# EAGLE design MF_badge_2021_rev_A (EAGLE 9.6.2)
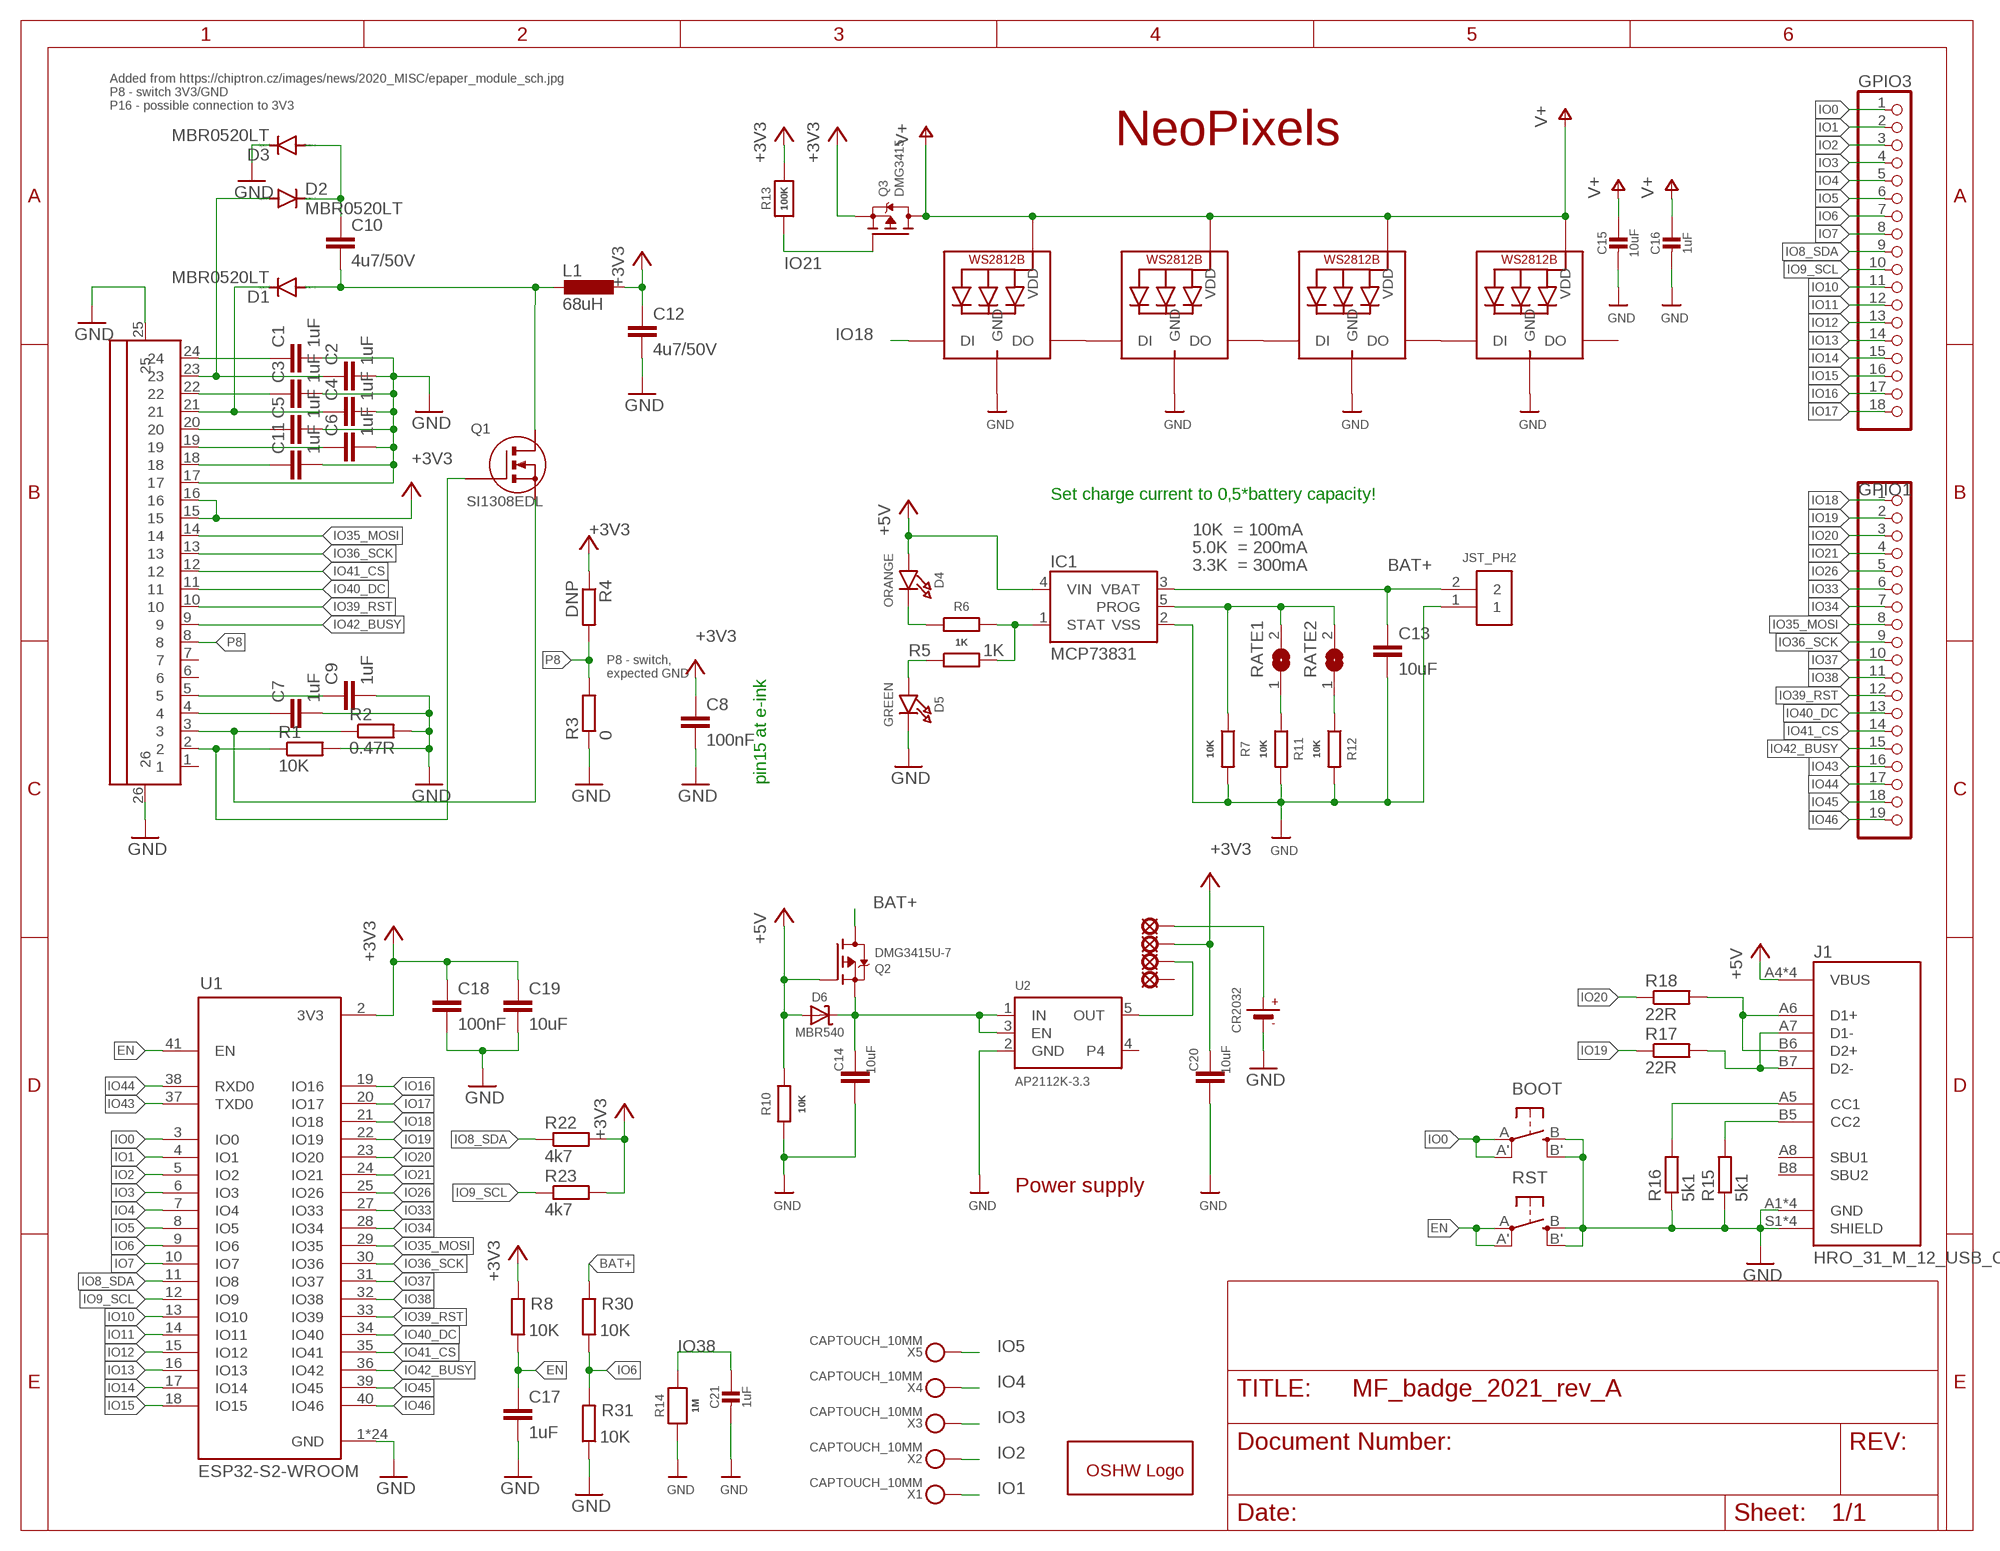
[diagram p0: schematic, sheet 1]

## Parts
BOOT  BUTTON_KMR2_4.6X2.8  [BUTTON_KMR2_4.6X2.8]
C1  1uF  C-EUC0603K  [C0603K]
C2  1uF  C-EUC0603K  [C0603K]
C3  1uF  C-EUC0603K  [C0603K]
C4  1uF  C-EUC0603K  [C0603K]
C5  1uF  C-EUC0603K  [C0603K]
C6  1uF  C-EUC0603K  [C0603K]
C7  1uF  C-EUC0603K  [C0603K]
C8  100nF  C-EUC0603K  [C0603K]
C9  1uF  C-EUC0603K  [C0603K]
C10  4u7/50V  C-EUC1206  [C1206]
C11  1uF  C-EUC0603K  [C0603K]
C12  4u7/50V  C-EUC1206  [C1206]
C13  10uF  C-EUC0603  [C0603]
C14  10uF  C-EUC0603  [C0603]
C15  10uF  CAP_CERAMIC0603_NO  [0603-NO]
C16  1uF  CAP_CERAMIC0603_NO  [0603-NO]
C17  1uF  C-EUC0603K  [C0603K]
C18  100nF  C-EUC0603K  [C0603K]
C19  10uF  C-EUC1206  [C1206]
C20  10uF  C-EUC0603  [C0603]
C21  1uF  CAP_CERAMIC0603_NO  [0603-NO]
CR2032  BATTERYCR2032_BAT-HLD-001  [CR2032_SMT_BAT-HLD-001]
D1  MBR0520LT  [SOD123]
D2  MBR0520LT  [SOD123]
D3  MBR0520LT  [SOD123]
D4  ORANGE  LED0603  [CHIPLED_0603]
D5  GREEN  LED0603  [CHIPLED_0603]
D6  MBR540  DIODE-SCHOTTKYSOD-123  [SOD-123]
GOLD_ORB_SM1  OSHWLOGO_  [OSHW_5MM_LOGO]
GPIO1  PINHD-1X19  [1X19]
GPIO3  PINHD-1X18  [1X18]
IC1  MCP73831  [SOT95P290X120-5]
J1  HRO_31_M_12_USB_C  [HRO_31_M_12_USB_C]
L1  68uH  L-EUL4532P  [L4532P]
LED2  WS2812B5050  [WS2812B]
LED3  WS2812B5050  [WS2812B]
LED4  WS2812B5050  [WS2812B]
LED5  WS2812B5050  [WS2812B]
LSP1  MCS10B  [MCS10B]
LSP2  MCS10B  [MCS10B]
LSP3  MCS10B  [MCS10B]
LSP4  MCS10B  [MCS10B]
Q1  SI1308EDL  [SC-70]
Q2  DMG3415U-7  MOSFET-P  [SOT23-R]
Q3  DMG3415  MOSFET-P  [SOT23-R]
R1  10K  R-EU_R0603  [R0603]
R2  0.47R  R-EU_R0603  [R0603]
R3  0  R-EU_R0603  [R0603]
R4  DNP  R-EU_R0603  [R0603]
R5  1K  R-EU_R0603  [R0603]
R6  1K  R-EU_R0603  [R0603]
R7  10K  R-EU_R0603  [R0603]
R8  10K  R-EU_R0603  [R0603]
R10  10K  R-EU_R0603  [R0603]
R11  10K  R-EU_R0603  [R0603]
R12  10K  R-EU_R0603  [R0603]
R13  100K  RESISTOR_0603_NOOUT  [0603-NO]
R14  1M  RESISTOR_0603_NOOUT  [0603-NO]
R15  5k1  R-EU_R0603  [R0603]
R16  5k1  R-EU_R0603  [R0603]
R17  22R  R-EU_R0603  [R0603]
R18  22R  R-EU_R0603  [R0603]
R22  4k7  R-EU_R0603  [R0603]
R23  4k7  R-EU_R0603  [R0603]
R30  10K  R-EU_R0603  [R0603]
R31  10K  R-EU_R0603  [R0603]
RATE1  SOLDERJUMPER  [SOLDERJUMPER_ARROW_NOPASTE]
RATE2  SOLDERJUMPER  [SOLDERJUMPER_ARROW_NOPASTE]
RST  BUTTON_KMR2_4.6X2.8  [BUTTON_KMR2_4.6X2.8]
U1  ESP32-S2-WROOM  [XCVR_ESP32-S2-WROOM]
U2  AP2112K-3.3  VREG_SOT23-5  [SOT23-5]
U$1  2.13_EINK  [2.13_EINK]
U$8  JST_PH2  [JSTPH2]
X1  CAPTOUCH_10MM  CAPTOUCH_MONOPAD_6X9  [CAPTOUCH_6X9MM]
X2  CAPTOUCH_10MM  CAPTOUCH_MONOPAD_6X9  [CAPTOUCH_6X9MM]
X3  CAPTOUCH_10MM  CAPTOUCH_MONOPAD_6X9  [CAPTOUCH_6X9MM]
X4  CAPTOUCH_10MM  CAPTOUCH_MONOPAD_6X9  [CAPTOUCH_6X9MM]
X5  CAPTOUCH_10MM  CAPTOUCH_MONOPAD_6X9  [CAPTOUCH_6X9MM]

## Nets
+3V3 [power]: C8.1 C12.1 C18.1 C19.1 C20.1 L1.1 LSP2.MP Q3.2(S) R4.1 R8.2 R13.2 R22.2 R23.2 U1.2(3V3) U$1.15 U$1.16
+5V [power]: D4.A D6.A IC1.4(VIN) J1.A4(VBUS) J1.A9(VBUS) J1.B4(VBUS) J1.B9(VBUS) Q2.1(G) R10.2
BAT+: C13.1 IC1.3(VBAT) Q2.3(D) R30.2 U$8.2
D+_CON: J1.A6(D1+) J1.B6(D2+) R18.2
D-_CON: J1.A7(D1-) J1.B7(D2-) R17.2
EN: C17.1 R8.1 RST.A'(P1) RST.A(P) U1.41(EN)
GND: BOOT.B'(S1) BOOT.B(S) C1.2 C2.2 C3.2 C4.2 C5.2 C6.2 C7.2 C8.2 C9.2 C11.2 C12.2 C13.2 C14.2 C15.2 C16.2 C17.2 C18.2 C19.2 C20.2 C21.2 CR2032.- D3.C D5.C IC1.2(VSS) J1.A1(GND) J1.A12(GND) J1.B1(GND) J1.B12(GND) J1.S1(SHIELD) J1.S2(SHIELD) J1.S3(SHIELD) J1.S4(SHIELD) LED2.3-GND(GND) LED3.3-GND(GND) LED4.3-GND(GND) LED5.3-GND(GND) R1.2 R2.2 R3.1 R7.2 R10.1 R11.2 R12.2 R14.1 R15.1 R16.1 R31.1 RST.B'(S1) RST.B(S) U1.1(GND) U1.26(GND) U1.42(GND) U1.43.1(GND) U1.43.2(GND) U1.43.3(GND) U1.43.4(GND) U1.43.5(GND) U1.43.6(GND) U1.43.7(GND) U1.43.8(GND) U1.43.9(GND) U1.43.10(GND) U1.43.11(GND) U1.43.12(GND) U1.43.13(GND) U1.43.14(GND) U1.43.15(GND) U1.43.16(GND) U1.43.17(GND) U1.43.18(GND) U1.43.19(GND) U1.43.20(GND) U1.43.21(GND) U2.2(GND) U$1.17 U$1.25 U$1.26 U$8.1
IO0: BOOT.A'(P1) BOOT.A(P) GPIO3.1 U1.3(IO0)
IO1: GPIO3.2 U1.4(IO1) X1.P$1
IO2: GPIO3.3 U1.5(IO2) X2.P$1
IO3: GPIO3.4 U1.6(IO3) X3.P$1
IO4: GPIO3.5 U1.7(IO4) X4.P$1
IO5: GPIO3.6 U1.8(IO5) X5.P$1
IO6: GPIO3.7 R30.1 R31.2 U1.9(IO6)
IO7: GPIO3.8 U1.10(IO7)
IO8_SDA: GPIO3.9 R22.1 U1.11(IO8)
IO9_SCL: GPIO3.10 R23.1 U1.12(IO9)
IO10: GPIO3.11 U1.13(IO10)
IO11: GPIO3.12 U1.14(IO11)
IO12: GPIO3.13 U1.15(IO12)
IO13: GPIO3.14 U1.16(IO13)
IO14: GPIO3.15 U1.17(IO14)
IO15: GPIO3.16 U1.18(IO15)
IO16: GPIO3.17 U1.19(IO16)
IO17: GPIO3.18 U1.20(IO17)
IO18: GPIO1.1 LED2.4-DIN(DI) U1.21(IO18)
IO19: GPIO1.2 R17.1 U1.22(IO19)
IO20: GPIO1.3 R18.1 U1.23(IO20)
IO21: GPIO1.4 Q3.1(G) R13.1 U1.24(IO21)
IO26: GPIO1.5 U1.25(IO26)
IO33: GPIO1.6 U1.27(IO33)
IO34: GPIO1.7 U1.28(IO34)
IO35_MOSI: GPIO1.8 U1.29(IO35) U$1.14
IO36_SCK: GPIO1.9 U1.30(IO36) U$1.13
IO37: GPIO1.10 U1.31(IO37)
IO38: C21.1 GPIO1.11 R14.2 U1.32(IO38)
IO39_RST: GPIO1.12 U1.33(IO39) U$1.10
IO40_DC: GPIO1.13 U1.34(IO40) U$1.11
IO41_CS: GPIO1.14 U1.35(IO41) U$1.12
IO42_BUSY: GPIO1.15 U1.36(IO42) U$1.9
IO43: GPIO1.16 U1.37(TXD0)
IO44: GPIO1.17 U1.38(RXD0)
IO45: GPIO1.18 U1.39(IO45)
IO46: GPIO1.19 U1.40(IO46)
N$1: C1.1 U$1.24
N$2: C2.1 D2.A U$1.23
N$3: C3.1 U$1.22
N$4: C4.1 D1.C U$1.21
N$5: C5.1 U$1.20
N$6: C6.1 U$1.19
N$7: C11.1 U$1.18
N$8: IC1.1(STAT) R5.2 R6.2
N$9: C14.1 D6.C Q2.2(S) U2.1(IN) U2.3(EN)
N$10: Q1.2(S) R2.1 U$1.3
N$11: C9.1 U$1.5
N$12: C7.1 U$1.4
N$13: Q1.1(G) R1.1 U$1.2
N$15: D4.C R6.1
N$16: C10.1 D2.C D3.A
N$17: LED2.2-DOUT(DO) LED3.4-DIN(DI)
N$18: D5.A R5.1
N$19: C10.2 D1.A L1.2 Q1.3(D)
N$20: R11.1 RATE1.1
N$21: R12.1 RATE2.1
N$22: LED4.2-DOUT(DO) LED5.4-DIN(DI)
N$23: J1.B5(CC2) R15.2
N$24: J1.A5(CC1) R16.2
N$25: LED3.2-DOUT(DO) LED4.4-DIN(DI)
N$26: CR2032.+$1(+) CR2032.+$2(+) LSP1.MP
OUT [power]: LSP3.MP U2.5(OUT)
P8: R3.2 R4.2 U$1.8
PROG: IC1.5(PROG) R7.1 RATE1.2 RATE2.2
V+: C15.1 C16.1 LED2.1-VDD(VDD) LED3.1-VDD(VDD) LED4.1-VDD(VDD) LED5.1-VDD(VDD) Q3.3(D)
Unconnected: J1.A8(SBU1) J1.B8(SBU2) LED5.2-DOUT(DO) LSP4.MP U2.4 U$1.1 U$1.6 U$1.7

## Notes on the sheet
- Added from https://chiptron.cz/images/news/2020_MISC/epaper_module_sch.jpg
  P8 - switch 3V3/GND
  P16 - possible connection to 3V3
- NeoPixels
- Set charge current to 0,5*battery capacity!
- 10K  = 100mA
- 5.0K  = 200mA
- 3.3K  = 300mA
- P8 - switch,
  expected GND
- pin15 at e-ink
- Power supply

## Library data of the parts
BOOT RST = dronecz:BUTTON_KMR2_4.6X2.8: SMT Tact Switches 6x6mm - Digikey: P12940SCT-ND KMR2 (4.6x2.8mm) - Digikey: 401-1426-1-ND EVQ-PQHB55 - Light Touch, 160GF (4.5x4.5mm) - Digikey: P8090SCT-ND Farnell (KMR221NG) - 2845727
C1-C14 C17-C20 = rcl:C-EU: CAPACITOR, European symbol; SPICEPREFIX: C
C15 C16 C21 = microbuilder:CAP_CERAMIC: Ceramic Capacitors For new designs, use the packages preceded by an '_' character since they are more reliable: The following footprints should be used on most boards: _0402 - Standard footprint for regular board layouts _0603 - Standard footprint for regular board layouts _0805 - Standard footprint for regular board layouts _1206 - Standard footprint for regular board layouts For extremely tight-pitch boards where space is at a premium, the following 'micro-pitch' footprints can be used (smaller pads, no silkscreen outline, etc.): _0402MP - Micro-pitch footprint for very dense/compact boards _0603MP - Micro-pitch footprint for very dense/compact boards _0805MP - Micro-pitch footprint for very dense/compact boards _1206MP - Micro-pitch footprint for very dense/compact boards
CR2032 = microbuilder:BATTERY: CR1220 SMT - Digikey: 3001K-ND CD2032 BAT-HLD-001 - Digikey: BAT-HLD-001-ND
D1-D3 = diode:MBR0520LT: SCHOTTKY BARRIER RECTIFIER Source: http://onsemi.com .. MBR0520LT1-D.pdf
D4 D5 = microbuilder:LED: LED 0603 - 0603 Surface Mount Package 2mA: Green LED - Low Power (3.9mcd, 2ma, 1.7Vf) - Digikey: 475-2709-2-ND Orange LED - Low Power (9.8mcd, 2ma, 1.8Vf) - Digikey: 475-1194-2-ND Red LED - Low Power (5mcd, 2ma, 1.8Vf) - Digikey: 475-1195-2-ND Yellow LED - Low Power (7mcd, 2ma, 1.8Vf) - Digikey: 475-1196-2-ND 5mA: Blue LED - Low Power (17mcd, 5ma, 2.9Vf) - Digikey: LNJ937W8CRACT-ND 0805 - 0805 Surface Mount Package 2mA: Red LED (8.8mcd, 2mA, 1.8Vf, Clear) - Low Power [Digikey: 475-2510-1-ND] Green LED (5mcd, 2mA, 1.8Vf, Clear) - Low Power [Digikey: 475-2730-1-ND] Yellow LED (11.3mcd, 2mA, 1.8Vf, Clear) - Low Power [Digikey: 475-2555-1-ND] 20mA: Red LED (104mcd, 20mA, Diffused) - LS R976 [Digikey: 475-1278-6-ND] Red LED (12mcd, 20mA, 2.0Vf, Clear) - APT2012EC [Digikey: 754-1128-1-ND] Green LED (15mcd, 20mA, 2.2Vf, Clear) - APT2012GC [Digikey: 754-1131-1-ND] Orange LED (160mcd, 20mA, 2.1Vf, Clear) - APT2012SECK [Digikey: 754-1130-1-ND] 1206 - 1206 Surface Mount Package Green LED (26mcd, 20mA, Diffused) - LG N971 [Digikey: 475-1407-6-ND] Red LED (15mcd, 20mA, Diffused) - LH N974 [Digikey: 475-1416-6-ND] Cree - Cree High-Power Surface Mount LEDs XPEBWT-L1-0000-00D50 - White 111lm 350mA 2.9Vf 6200K 110° XTEAWT-00-0000-00000LEE3 - White 114lm 350mA 2.85Vf 5000K 115° Everlight - Everlight 45-21 Series Surface Mount LEDs 45-21/QK2C-B2832AC2CB2/2T - Warm White 2000mcd 20mA 3.25Vf 3050K 120° 45-21/LK2C-B38452C4CB2/2T - Nuetral White 2000mcd 20mA 3.25Vf 4150K 120° 45-21/LK2C-B50634C6CB2/2T - Cold White 2200mcd 20mA 3.25Vf 5650K 120° PLCC2 Reverse Mount LS T77K-J1L2-1-0-2-R18-Z - Red 11.25mcd 2mA 1.8Vf 630nm 120° LO T77K-L1M2-24-Z - Orange 19.6mcd 2mA 1.8Vf 606nm 120° LY T77K-K2M1-26-Z - Yellow 15.7mcd 2mA 1.8Vf 587nm 120°
D6 = microbuilder:DIODE-SCHOTTKY
GOLD_ORB_SM1 = oshw:OSHWLOGO: The OSHW logo for PCB layout
GPIO1 = pinhead:PINHD-1X19: PIN HEADER
GPIO3 = pinhead:PINHD-1X18: PIN HEADER
IC1 = Bastlir:MCP73831
J1 = Bastlir:HRO_31_M_12_USB_C: USB Shielded I/O Receptacle; Type C; Right Angle; Surface Mount; Gold over Nickel
L1 = rcl:L-EU: INDUCTOR, European symbol; SPICEPREFIX: L
LED2-LED5 = microbuilder:WS2812B
LSP1-LSP4 = solpad:MCS10B: SOLDER PAD MC S1, distributor Buerklin, 15F505
Q1 = tr-j:SI1308EDL
Q2 Q3 = microbuilder:MOSFET-P: P-Channel Mosfet LEGEND VDS: Voltage Drain-Source ID: Drain Current RDS(ON): Drain-Source On-State Resistance VGS(TH): Gate-Source Threshold Voltage CISS: Drain-Source Input Capacitance SOT-23 Name VDS ID RDS(ON) VGS(TH) CISS Order Number IRLML5103 30V 760mA 600 mOhm -- 75pF @ 25V Digikey: IRLML5103PBFCT-ND IRLML6401 12V 4.3A 50 mOhm 950mV @ 250µA 830pF @ 10V Digikey: IRLML6401PBFTR-ND NTR0202PL 20V 400mA 800 mOhm 2.3V @ 250uA 70pF @ 5V Digikey: NTR0202PLT1GOSTR-ND NTR4101PT1G 20V 1.8A 85 mOhm 1.2V @ 250uA 675pF @ 10V Digikey: NTR4101PT1GOSCT-ND DMP2004K 20V 600mA 900 mOhm 1V @ 250uA 175pF @ 16V Digikey: DMP2004KDICT-ND PMV65XP 20V 3.9A 76 mOhm 950mV @ 1mA 725pF @ 20V Digikey: 568-2358-2-ND TO-252 Name VDS ID RDS(ON) VGS(TH) CISS Order Number AOD417 30V 25A 34 mOhm 3V @ 250µA 920pF @ 15V Digikey: 785-1106-2-ND PowerPak Name VDS ID RDS(ON) VGS(TH) CISS Order Number AON7401 30V 12A 14 mOhm 3V @ 250µA 2600pF @ 15V Digikey: 785-1302-1-ND
R1-R8 R10-R12 R15-R18 R22 R23 R30 R31 = rcl:R-EU_: RESISTOR, European symbol; SPICEPREFIX: R
R13 R14 = microbuilder:RESISTOR: Resistors For new designs, use the packages preceded by an '_' character since they are more reliable: The following footprints should be used on most boards: _0402 - Standard footprint for regular board layouts _0603 - Standard footprint for regular board layouts _0805 - Standard footprint for regular board layouts _1206 - Standard footprint for regular board layouts For extremely tight-pitch boards where space is at a premium, the following 'micro-pitch' footprints can be used (smaller pads, no silkscreen outline, etc.): _0402MP - Micro-pitch footprint for very dense/compact boards _0603MP - Micro-pitch footprint for very dense/compact boards _0805MP - Micro-pitch footprint for very dense/compact boards _1206MP - Micro-pitch footprint for very dense/compact boards
RATE1 RATE2 = microbuilder:SOLDERJUMPER: SMD Solder JUMPER Solder the two pads together to create a connection, or remove the solder to break it. REFLOW - Use this footprint for solder paste and reflow ovens. WAVE - Use this footprint for hand-soldering (larger pads). CLOSED - Has a trace between the two pads to ensure it is closed by default. The trace needs to be cut to disable the jumper, and can be closed again by creating a solder bridge between the two pads.; BOM: EXCLUDE
U1 = Bastlir:ESP32-S2-WROOM: WiFi 802.11b/g/n Transceiver Module 2.4GHz PCB Trace Surface Mount Check prices <https://pricing.snapeda.com/search/part/ESP32-S2-WROOM/?ref=eda>; AVAILABILITY: Bad; DESCRIPTION: WiFi 802.11b/g/n Transceiver Module 2.4GHz PCB Trace Surface Mount; MF: Espressif Systems; MP: ESP32-S2-WROOM; PACKAGE: VFQFN-56 Espressif Systems; PRICE: None
U2 = microbuilder:VREG_SOT23-5: SOT23-5 Fixed Voltage Regulators Part Current Out V Out V In V Dropout θJA (°C/W) TJ (°C) Digikey Part No. ADP121 150mA 3.3V 3.4-5.5V 0.09V @ 150mA -- -- ADP121-AUJZ33R7CT-ND ADP121 150mA 3.0V 3.1-5.5V 0.09V @ 150mA -- -- ADP121-AUJZ30R7CT-ND ADP122 300mA 3.3V 3.4-5.5V 0.085V @ 300mA -- -- ADP122AUJZ-3.3-R7CT-ND ADP1712 300mA 3.3V 3.5-5.5V 0.17V @ 300mA -- -- ADP1712AUJZ-3.3-R7TR-ND AP7311 (Low Cost) 150mA 3.3V 3.5-6V 0.15V @ 150mA -- -- AP7311-33WG-7DICT-ND LD39015M18R 150mA 1.8V 1.9V-5.5V 0.08V @ 100mA -- -- 497-6977-1-ND LP2985A-33DBVR 150mA 3.3V 3.3-16V 0.28V @ 150mA 206 150 296-18479-1-ND MCP1824T-3302E/OT 300mA 3.3V 3.5V-6V 0.2V @ 300mA -- -- MCP1824T-3302E/OTCT-ND MIC5205-2.5YM5 TR 150mA 2.5V 2.7-16V 0.165V @ 150mA -- -- 576-1257-2-ND MIC5205-3.0YM5 TR 150mA 3.0V 3.2V-16V 0.165V @ 150mA -- -- 576-1258-2-ND MIC5205-3.3YM5 TR 150mA 3.3V 3.5V-16V 0.165V @ 150mA -- -- 576-1259-2-ND TPS780330220 150mA 3.3V+2.2V 3.6-5.5V 250mV Max -- -- 296-23332-1-ND TDA3663/N1,135 100mA 3.3V 3.5-45V 0.18V @ 50mA -- -- 568-5343-1-ND Max operating temp can be calculated using θJA, TJ (max junction temperature), and power in watts. Set the "Maximum Ambient Temperature" until it reaches TJ ("Max Junction Temperature"), which is the absolute limit for safe use of the regulator: Heat Sink Temperature Calculator <http://www.daycounter.com/Calculators/Heat-Sink-Temperature-Calculator.phtml> For example, With 12V source into a 3.3V LP2985 and a 30mA load, we are dissipating (12V-3.3V) * 0.03A = 0.261W. With a θJA of 206 °C/W, a TJ of 150°C, and 261mW we can safely use the chip without a heat sink up to 75°C (=147.1°C Junction Temperature).
U$1 = dronecz:2.13_EINK
U$8 = Bastlir:JST_PH2
X1-X5 = adafruit_electromech:CAPTOUCH_MONOPAD

## Net classes
1 power: width 0.508 mm
2 lowpower: width 0.305 mm, drill 0.483 mm

## Board
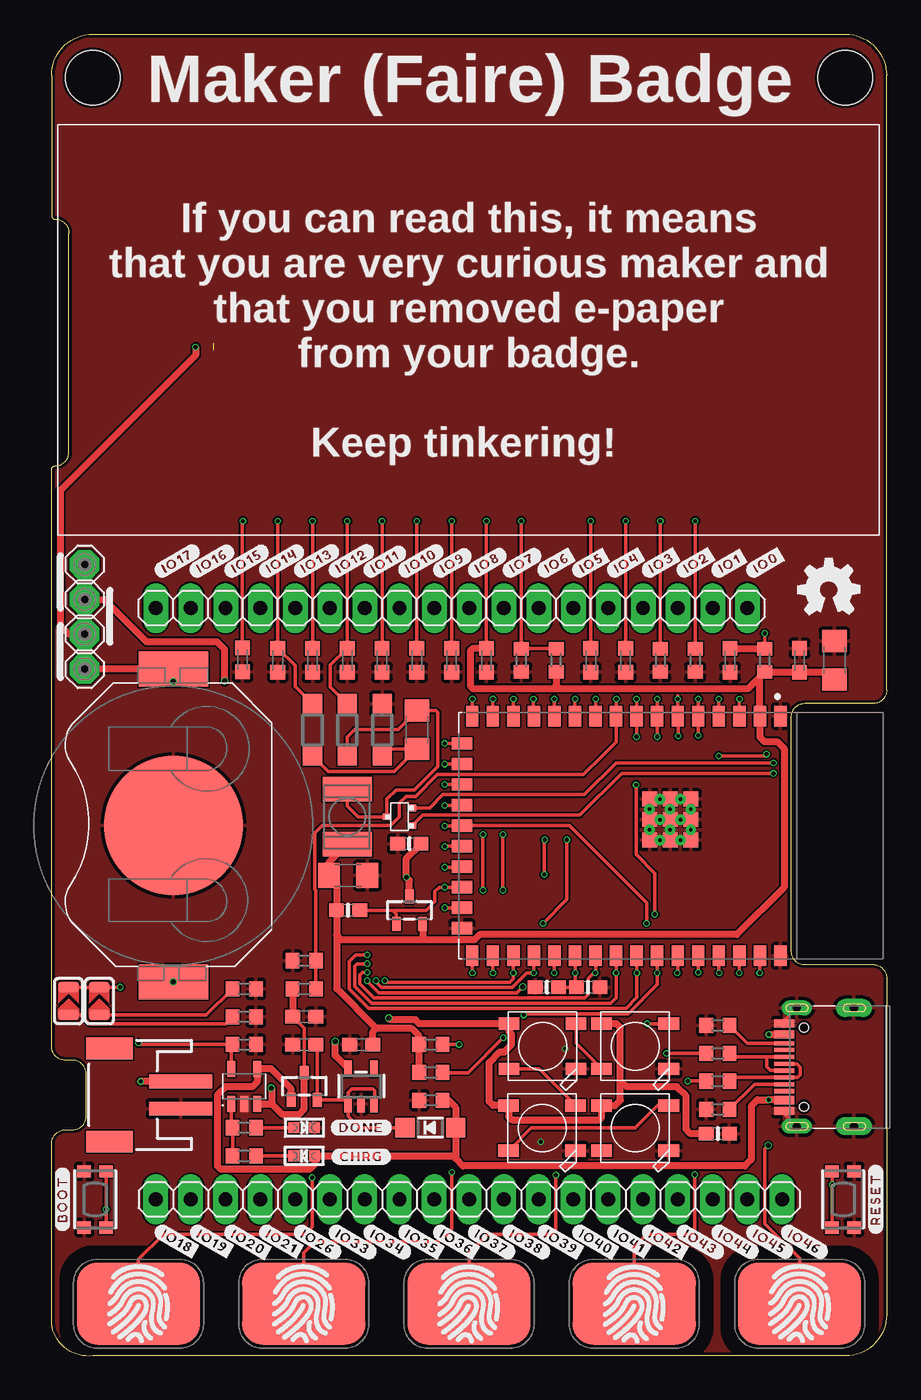
[diagram p1: board, top side]
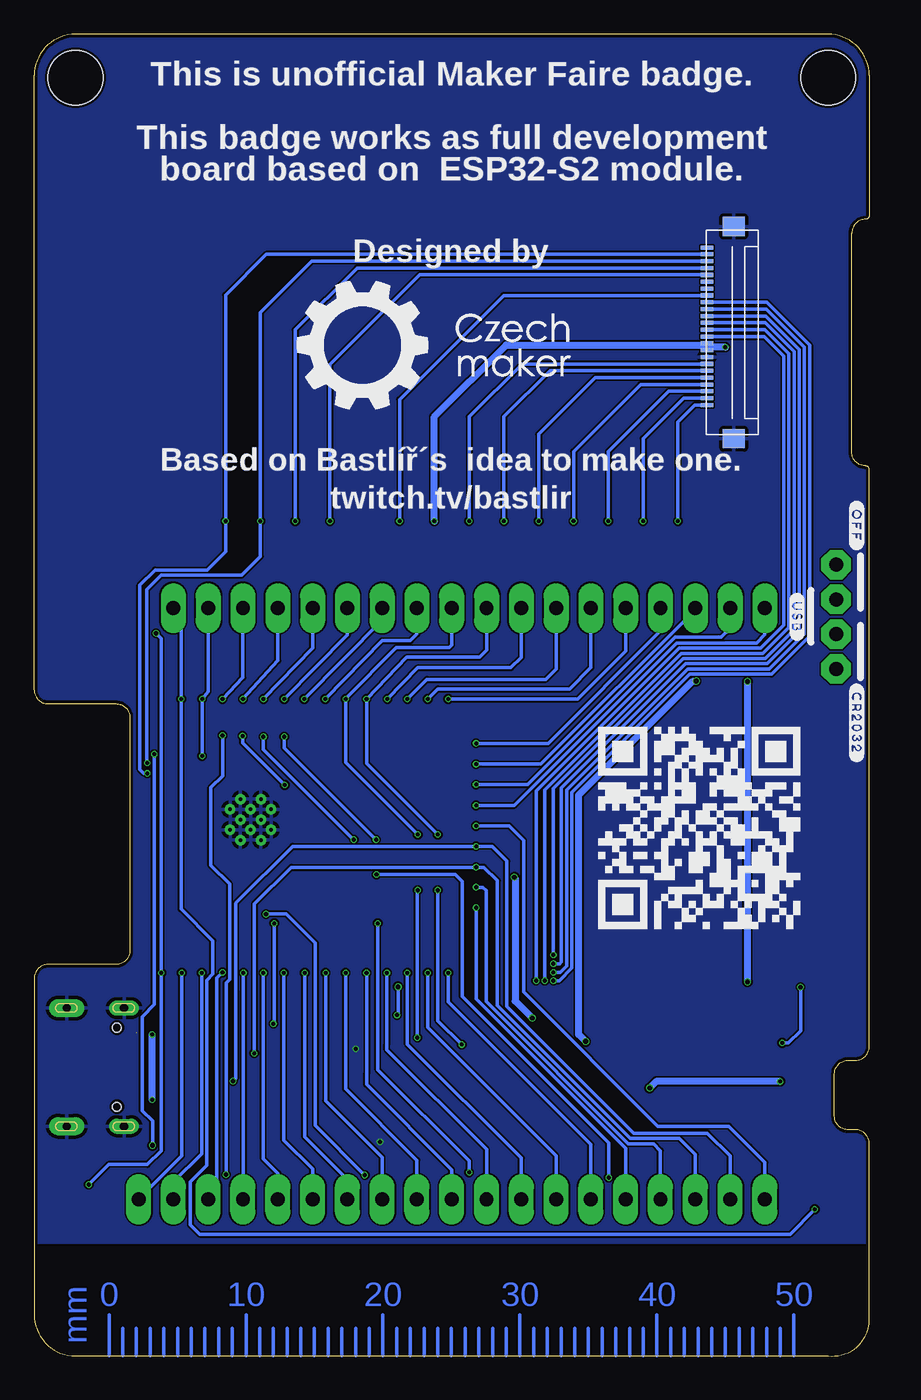
[diagram p2: board, bottom side, seen from below]

Size 60.96 x 96.54 mm. Coordinates in mm from the lower left corner, seen from the top.
Outline: 60.96,27.59 60.96,3.02 arc-90 57.96,0.02 3,0.02 arc-90 0,2.38 0,15.53 arc-90 1,16.53 1.54,16.53 arc90 2.54,17.53 2.54,20.61 arc90 1.54,21.61 1,21.61 arc-90 0,22.61 0,64.75 arc-90 0.27,65.02 arc90 1.27,66.02 1.27,82.02 arc90 0.27,83.02 arc-90 0,83.29 0,93.54 arc-90 3,96.54 57.96,96.54 arc-90 60.96,93.54 60.96,48.64 arc-90 59.96,47.64 54.98,47.64 arc90 53.98,46.64 53.98,29.59 arc90 54.98,28.59 59.96,28.59 arc-90 60.96,27.59
Copper layers (1*16): Top 0.035mm / dielectric 1.6mm / Bottom 0.035mm
Design rules "jlcpcb2layer *": minimum track width 5mil, minimum drill 0.3mm, track to track 5mil, track to pad 5mil, pad to pad 5mil, via to via 5mil, smd to smd 5mil, copper to edge 0.2mm, drill to drill 6mil, minimum pad ring 10mil, minimum via ring 3mil, stop-mask expansion 4mil, vias tented up to drill 0mil, thermal gap 10mil
Holes 4 mm at 57.95,93.36 3,93.36
bRestrict: area 0,0 to 60.9,8.2

### Footprints (pad centres in the part's own frame; a part is rotated, then mirrored left to right if it is on the bottom)
BUTTON_KMR2_4.6X2.8 = smd 0.9 x 1: A 2.05,0.8; A' -2.05,0.8; B 2.05,-0.8; B' -2.05,-0.8
C0603K = smd 1.05 x 1.08: 1 -0.875,0; 2 0.875,0
C1206 = smd 1.6 x 1.8: 1 -1.4,0; 2 1.4,0
C0603 = smd 1.1 x 1: 1 -0.85,0; 2 0.85,0
0603-NO = smd 1.075 x 1: 1 -0.85,0; 2 0.85,0
CR2032_SMT_BAT-HLD-001 = smd 2.54 x 5.08: +$1 -11.43,0; +$2 11.43,0 | smd 10.16 x 10.16: - 0,0
SOD123 = smd 1.4 x 1.4: A 1.9,0; C -1.9,0
CHIPLED_0603 = smd 0.8 x 0.8: A 0,-0.75; C 0,0.75
SOD-123 = smd 1.4 x 1.4: A 1.85,0; C -1.85,0
1X19 = drill 1.016 long: 1 -22.86,0; 2 -20.32,0; 3 -17.78,0; 4 -15.24,0; 5 -12.7,0; 6 -10.16,0; 7 -7.62,0; 8 -5.08,0; 9 -2.54,0; 10 0,0; 11 2.54,0; 12 5.08,0; 13 7.62,0; 14 10.16,0; 15 12.7,0; 16 15.24,0; 17 17.78,0; 18 20.32,0; 19 22.86,0
1X18 = drill 1.016 long: 1 -21.59,0; 2 -19.05,0; 3 -16.51,0; 4 -13.97,0; 5 -11.43,0; 6 -8.89,0; 7 -6.35,0; 8 -3.81,0; 9 -1.27,0; 10 1.27,0; 11 3.81,0; 12 6.35,0; 13 8.89,0; 14 11.43,0; 15 13.97,0; 16 16.51,0; 17 19.05,0; 18 21.59,0
SOT95P290X120-5 = smd 1.18 x 0.609: 1 -1.274,0.95; 2 -1.274,0; 3 -1.274,-0.95; 4 1.274,-0.95; 5 1.274,0.95
HRO_31_M_12_USB_C = smd 0.3 x 1.45: A1 -3.35,4.045; A4 -2.55,4.045; A5 -1.25,4.045; A6 -0.25,4.045; A7 0.25,4.045; A8 1.25,4.045; A9 2.55,4.045; A12 3.35,4.045; B1 3.05,4.045; B4 2.25,4.045; B5 1.75,4.045; B6 0.75,4.045; B7 -0.75,4.045; B8 -1.75,4.045; B9 -2.25,4.045; B12 -3.05,4.045 | drill 0.6 pad 1.1 long: S1 -4.32,3.13; S2 4.32,3.13 | drill 0.6 pad 1.3 long: S3 -4.32,-1.05; S4 4.32,-1.05 | hole 0.65: -2.89,2.6; 2.89,2.6
L4532P = smd 1.8 x 3.6: 1 -2,0; 2 2,0
WS2812B = smd 1.5 x 0.9: 1-VDD 2.45,-1.65; 2-DOUT 2.45,1.65; 3-GND -2.45,1.65; 4-DIN -2.45,-1.65
MCS10B = drill 1.016 pad 2.159 octagon: MP 0,0
SC-70 = smd 0.5 x 0.6: 1 -0.65,-0.93; 2 0.65,-0.93; 3 0,0.93
SOT23-R = smd 0.635 x 1.016: 1 -0.95,-1; 2 0.95,-1; 3 0,1
R0603 = smd 1 x 1.1: 1 -0.85,0; 2 0.85,0
SOLDERJUMPER_ARROW_NOPASTE = smd 0.762 x 1.524: 1 -1.016,0; 2 1.016,0
XCVR_ESP32-S2-WROOM = smd 1.5 x 0.9: 1 -8.75,8; 2 -8.75,6.5; 3 -8.75,5; 4 -8.75,3.5; 5 -8.75,2; 6 -8.75,0.5; 7 -8.75,-1; 8 -8.75,-2.5; 9 -8.75,-4; 10 -8.75,-5.5; 11 -8.75,-7; 12 -8.75,-8.5; 13 -8.75,-10; 14 -8.75,-11.5; 15 -8.75,-13; 16 -8.75,-14.5; 27 8.75,-14.5; 28 8.75,-13; 29 8.75,-11.5; 30 8.75,-10; 31 8.75,-8.5; 32 8.75,-7; 33 8.75,-5.5; 34 8.75,-4; 35 8.75,-2.5; 36 8.75,-1; 37 8.75,0.5; 38 8.75,2; 39 8.75,3.5; 40 8.75,5; 41 8.75,6.5; 42 8.75,8 | smd 0.9 x 1.5: 17 -6.75,-15.25; 18 -5.25,-15.25; 19 -3.75,-15.25; 20 -2.25,-15.25; 21 -0.75,-15.25; 22 0.75,-15.25; 23 2.25,-15.25; 24 3.75,-15.25; 25 5.25,-15.25; 26 6.75,-15.25 | smd 1.1 x 1.1: 43.1 -1.19,-0.05; 43.2 -2.69,-0.05; 43.3 0.31,-0.05; 43.4 -2.69,-1.55; 43.5 -1.19,-1.55; 43.6 0.31,-1.55; 43.7 -2.69,1.45; 43.8 -1.19,1.45; 43.9 0.31,1.45 | drill 0.25 pad 0.4: 43.10 -1.19,0.7; 43.11 -2.69,0.7; 43.12 0.31,0.7; 43.13 -2.69,-0.8; 43.14 -1.19,-0.8; 43.15 0.31,-0.8; 43.16 -1.94,1.45; 43.17 -0.44,1.45; 43.18 -1.94,-0.05; 43.19 -0.44,-0.05; 43.20 -1.94,-1.55; 43.21 -0.44,-1.55
SOT23-5 = smd 0.55 x 1.2: 1 -0.95,-1.3; 2 0,-1.3; 3 0.95,-1.3; 4 0.95,1.3; 5 -0.95,1.3
2.13_EINK = smd 0.9 x 0.3 bottom: 1 -18.6,6.015; 2 -18.6,5.515; 3 -18.6,5.015; 4 -18.6,4.515; 5 -18.6,4.015; 6 -18.6,3.515; 7 -18.6,3.015; 8 -18.6,2.515; 9 -18.6,2.015; 10 -18.6,1.515; 11 -18.6,1.015; 12 -18.6,0.515; 13 -18.6,0.015; 14 -18.6,-0.485; 15 -18.6,-0.985; 16 -18.6,-1.485; 17 -18.6,-1.985; 18 -18.6,-2.485; 19 -18.6,-2.985; 20 -18.6,-3.485; 21 -18.6,-3.985; 22 -18.6,-4.485; 23 -18.6,-4.985; 24 -18.6,-5.485 | smd 1.6 x 1.4 bottom: 25 -20.55,7.55; 26 -20.55,-7.95
JSTPH2 = smd 1 x 4.6: 1 -1,-3.7; 2 1,-3.7 | smd 1.6 x 3.4: NC1 -3.4,1.5; NC2 3.4,1.5
CAPTOUCH_6X9MM = smd 9 x 6: P$1 0,0

### Placement (x,y rotation side)
BOOT  3.17,11.45 270 top
C1  13.94,50.85 270 top
C2  16.51,50.82 270 top
C3  19.05,50.82 270 top
C4  21.59,50.82 270 top
C5  24.13,50.82 270 top
C6  26.67,50.82 270 top
C7  41.91,50.82 270 top
C8  31.75,50.82 270 top
C9  39.37,50.82 270 top
C10  26.67,45.74 90 top
C11  29.21,50.82 270 top
C12  21.65,35.1 0 top
C13  18.45,24.78 0 top
C14  18.45,22.75 180 top
C15  48.64,16.24 0 top
C16  26.13,37.42 180 top
C17  49.53,50.82 270 top
C18  54.61,50.82 90 top
C19  57.15,50.82 90 top
C20  22.61,22.75 180 top
C21  36.16,26.94 180 top
CR2032  8.89,38.75 270 top
D1  21.59,45.74 270 top
D2  19.05,45.74 90 top
D3  24.13,45.74 270 top
D4  18.45,14.62 90 top
D5  18.45,16.69 270 top
D6  27.65,16.69 0 top
GOLD_ORB_SM1  56.74,55.96 0 top
GPIO1  30.48,11.45 0 top
GPIO3  29.21,54.63 180 top
IC1  14.07,19.7 90 top
J1  57.53,21.1 90 top
L1  21.59,39.39 90 top
LED2  42.61,22.62 180 top
LED3  35.85,22.62 180 top
LED4  35.81,16.65 180 top
LED5  42.61,16.65 180 top
LSP1  2.41,50.18 0 top
LSP2  2.41,52.72 0 top
LSP3  2.41,55.26 0 top
LSP4  2.41,57.8 0 top
Q1  25.4,39.39 90 top
Q2  18.45,19.7 0 top
Q3  26.13,32.56 0 top
R1  46.99,50.82 270 top
R2  44.45,50.82 270 top
R3  34.29,50.82 90 top
R4  36.83,50.82 90 top
R5  14.07,16.69 180 top
R6  14.07,14.62 180 top
R7  14.07,22.75 0 top
R8  52.07,50.82 270 top
R10  27.69,18.69 0 top
R11  14.07,26.81 0 top
R12  14.07,24.78 0 top
R13  21.65,32.56 180 top
R14  39.18,26.94 180 top
R15  48.64,24.15 0 top
R16  48.64,18.02 0 top
R17  48.64,20.08 0 top
R18  48.64,22.12 0 top
R22  27.69,20.72 180 top
R23  27.69,22.75 180 top
R30  18.45,26.81 180 top
R31  18.45,28.88 0 top
RATE1  3.49,25.93 90 top
RATE2  1.24,25.93 90 top
RST  57.78,11.45 90 top
U1  45.21,37.99 270 top
U2  22.61,19.7 0 top
U$1  30.44,74.95 0 top
U$2  [#IO43#0]  45.72,9.29 330 top
U$3  [#IO44#0]  48.26,9.29 330 top
U$7  [#BOOT#0]  0.79,11.45 90 top
U$8  5.71,19.07 90 top
U$9  [#RESET#0]  60.17,11.45 90 top
U$11  [#DONE#0]  22.61,16.69 0 top
U$12  [#CHRG#0]  22.61,14.56 0 top
U$16  [#IO18#0]  7.62,9.29 330 top
U$17  [#IO19#0]  10.19,9.29 330 top
U$18  [#IO20#0]  12.7,9.29 330 top
U$19  [#IO21#0]  15.24,9.29 330 top
U$20  [#IO26#0]  17.78,9.29 330 top
U$21  [#IO33#0]  20.32,9.29 330 top
U$22  [#IO34#0]  22.86,9.29 330 top
U$23  [#IO35#0]  25.4,9.29 330 top
U$24  [#IO36#0]  27.94,9.29 330 top
U$25  [#IO38#0]  33.02,9.29 330 top
U$26  [#IO37#0]  30.48,9.29 330 top
U$27  [#IO39#0]  35.56,9.29 330 top
U$28  [#IO40#0]  38.1,9.29 330 top
U$29  [#IO41#0]  40.64,9.29 330 top
U$30  [#IO42#0]  43.18,9.29 330 top
U$31  [#IO45#0]  50.8,9.29 330 top
U$32  [#IO46#0]  53.34,9.29 330 top
U$33  [#IO17#0]  7.62,57.17 30 top
U$34  [#IO16#0]  10.16,57.17 30 top
U$35  [#IO15#0]  12.7,57.17 30 top
U$37  [#IO14#0]  15.24,57.17 30 top
U$38  [#IO13#0]  17.78,57.17 30 top
U$39  [#IO12#0]  20.32,57.17 30 top
U$40  [#IO11#0]  22.86,57.17 30 top
U$41  [#IO10#0]  25.4,57.17 30 top
U$42  [#IO9#0]  27.94,57.17 30 top
U$43  [#IO8#0]  30.48,57.17 30 top
U$44  [#IO7#0]  33.02,57.17 30 top
U$45  [#IO6#0]  35.56,57.17 30 top
U$46  [#IO5#0]  38.1,57.17 30 top
U$47  [#IO4#0]  40.64,57.17 30 top
U$48  [#IO3#0]  43.18,57.17 30 top
U$49  [#IO2#0]  45.72,57.17 30 top
U$50  [#IO1#0]  48.26,57.17 30 top
U$51  [#IO0#0]  50.8,57.17 30 top
U$54  [#USB#0]  5.27,53.99 270 bottom
U$55  [#CR2032#0]  0.92,46.25 270 bottom
U$56  [#OFF#0]  0.92,60.66 270 bottom
X1  54.61,3.83 0 top
X2  42.55,3.83 0 top
X3  30.48,3.83 0 top
X4  18.41,3.83 0 top
X5  6.34,3.83 0 top

### Tracks (layer width: path | path; a pad name or v marks a point on that pad's centre or on a via)
+3V3  (via drill 0.3)  (2 unrouted)
  Top 0.254: C8.1 v31.75,60.98
  Top 0.508: 51.71,49.61 U1.2 51.71,45.21 52.04,44.88 52.98,44.88 53.48,44.37 53.48,34.23 50.04,30.78 31.24,30.78 30.87,30.41 27.24,30.41 | 51.71,49.61 R8.2 54.59,49.97 C18.1 56.62,49.94 C19.1 | R4.1 36.83,48.98 37.05,48.75 | 37.05,48.75 50.86,48.75 51.71,49.61 | L1.1 20.25,36.05 C12.1 20.8,34.55 R13.2 20.8,30.75 | R22.2 R23.2 26.84,23.38 26.29,23.93 23.72,23.93 | 20.8,30.75 20.8,26.84 23.72,23.93 | 20.8,30.75 21.14,30.41 27.24,30.41 | Q3.2 27.08,30.57 27.24,30.41 | C8.1 30.75,51.69 30.57,51.52 30.57,48.94 30.77,48.75 37.05,48.75 | C20.1 23.46,23.66 23.72,23.93 | LSP2.MP 1.27,52.72 0.64,53.36 0.64,63.22 10.51,73.09 v10.51,73.68
  Bottom 0.508: v31.75,60.98 31.75,68.6 26.51,73.84 11.84,73.84 | 11.84,73.84 11.84,73.62 | v10.51,73.68 11.68,73.68 11.84,73.84
+5V  (via drill 0.3)  (1 unrouted)
  Top 0.254: J1.A4 J1.B9 | 53.32,23.48 53.45,23.62 53.49,23.62 | J1.B4 J1.A9
  Top 0.305: J1.B9 53.35,18.72
  Top 0.508: 53.35,18.72 v52.36,18.72 51.53,18.72 51.09,18.27 51.09,14.37 50.61,13.89 30.04,13.89 29.5,14.42 | Q2.1 17.5,19.51 16.03,20.98 IC1.4 15.02,20.02 14.67,19.67 12.7,19.67 12.1,19.07 12.1,13.89 12.3,13.69 18.9,13.69 19.2,13.99 D4.A 29.3,14.62 29.5,14.42 | 29.5,14.42 D6.A 29.5,18.16 28.98,18.69 R10.2 | v52.36,23.48 53.32,23.48
  Bottom 0.508: v52.36,18.72 v52.36,23.48
BAT+  (via drill 0.3, 0.35)
  Top 0.254: Q2.3 18.45,23.93 C13.1
  Top 0.508: U$8.2 6.52,20.07 v6.51,20.05 | IC1.3 16.07,18.43 | Q2.3 18.45,18.05 18.07,17.67 16.83,17.67 16.07,18.43 | R30.2 C13.1 | v16.03,19.58 16.07,19.54 16.07,18.43
  Bottom 0.508: v6.51,20.05 15.56,20.05 v16.03,19.58
D+_CON
  Top 0.254: J1.B6 52.2,21.85 | 52.2,21.85 49.76,21.85 R18.2 | J1.A6 52.48,20.85 52.2,21.13 52.2,21.85
D-_CON
  Top 0.254: R17.2 49.76,20.35 J1.B7 54.46,20.35 54.64,20.53 54.64,21.1 54.39,21.35 J1.A7
EN  (via drill 0.3)
  Top 0.254: U1.41 51.71,28.08 v51.69,27.99 | R8.1 v52.07,52.79 | RST.A' v56.98,12.53 RST.A
  Top 0.508: C17.1 52.05,51.69 R8.1
  Bottom 0.254: v52.07,52.79 51.69,52.41 v51.69,27.99 51.69,15 52.7,13.99 55.52,13.99 v56.98,12.53
GND  (via drill 0.3)
  Top 0.254: J1.S1 53.49,17.69 J1.A1 | J1.S2 53.49,24.5 J1.B1
  other vias: 35.72,15.64 37.5,22.43
  pour Top: -1.27,-1.25 63.5,-1.25 63.5,100.35 -1.27,100.35
  pour Bottom: 64.77,-2.52 -2.54,-2.52 -2.54,101.62 64.77,101.62
IO0  (via drill 0.3)
  Top 0.254: U1.3 50.21,48.04 v50.23,47.99 | BOOT.A v3.98,10.72 BOOT.A'
  Bottom 0.254: GPIO3.1 50.23,54.06 v50.23,47.99 50.23,32.66 47.91,30.34 47.91,27.89 48.35,27.45 48.35,13.92 49.56,12.72 49.56,9.57 48.9,8.91 5.79,8.91 v3.98,10.72
IO1  (via drill 0.3, 0.35)
  Top 0.254: U1.4 48.71,48.08 v48.7,47.99 | X1.P$1 54.61,7.13 52.07,9.67 52.07,15.13 v52.32,15.38 | v52.2,43.96 52.07,43.83 v48.7,43.83
  Bottom 0.254: GPIO3.2 48.26,48.53 v48.7,47.99 v48.7,43.83 | v52.32,15.38 52.32,17.16 53.09,17.92 53.09,24.78 52.2,25.67 v52.2,43.96
IO2  (via drill 0.3)
  Top 0.254: v47.21,47.99 47.21,48.06 U1.5 v47.21,45.32 | v47.21,45.32 | v46.96,13.26 46.96,9.1 46.74,8.88 43.47,8.88 42.55,7.96 X2.P$1
  Bottom 0.254: v47.21,47.99 45.72,49.55 GPIO3.3 | v47.21,45.32 47.21,42.37 48.07,41.51 48.07,35.83 46.7,34.47 46.7,30.5 46.7,27.51 46.96,27.26 v46.96,13.26
IO3  (via drill 0.3)
  Top 0.254: v45.72,47.99 45.71,48.24 U1.6 45.75,46.7 v45.75,45.29 | X3.P$1 30.48,7.54 31.84,8.91 36.48,8.91 36.82,9.25 v36.82,13.22 | v44.04,32.28 44.04,35.26 42.67,36.63 v42.67,41.71
  Bottom 0.254: v45.72,47.99 43.18,50.79 GPIO3.4 | v36.82,13.22 40.44,16.84 40.44,30.17 42.55,32.28 v44.04,32.28 | v42.67,41.71 45.75,44.78 v45.75,45.29
IO4  (via drill 0.3)
  Top 0.254: v44.23,47.99 44.21,48.1 U1.7 44.21,45.25 v44.23,45.23 | v37.62,37.71 37.62,33.35 v35.88,31.61 | v29.21,13.42 29.21,9.29 28.25,8.33 19.2,8.33 18.41,7.54 X4.P$1
  Bottom 0.254: v44.23,47.99 40.64,51.71 GPIO3.5 | v44.23,45.23 44.23,44.31 v37.62,37.71 | v29.21,13.42 29.21,14.24 35.88,20.91 v35.88,31.61
IO5  (via drill 0.3)
  Top 0.254: v42.7,47.99 42.71,48.05 U1.8 42.71,45.24 v42.7,45.23 | X5.P$1 6.34,7.06 8.19,8.91 18.48,8.91 19.02,9.45 v19.02,13.04 | v35.97,35.16 35.97,37.68 v36.01,37.71
  Bottom 0.254: v42.7,47.99 38.1,52.66 GPIO3.6 | v19.02,13.04 19.02,15.57 29.72,26.27 29.72,34.66 30.23,35.16 v35.97,35.16 | v36.01,37.71 42.7,44.41 v42.7,45.23
IO6  (via drill 0.3)
  Top 0.254: v41.24,47.99 41.21,48.02 U1.9 41.21,44.85 40.26,43.9 40.23,43.86 38.83,42.47 28.16,42.47 26.57,40.88 25.88,40.88 25.4,40.4 25.4,39.39 24.77,38.75 19.75,38.75 19.2,38.2 19.2,34.1 19.3,34 R31.2 R30.1
  Bottom 0.254: v41.24,47.99 35.56,53.74 GPIO3.7
IO7  (via drill 0.3)
  Top 0.254: U1.10 39.71,48.08 v39.72,47.99
  Bottom 0.254: v39.72,47.99 35.56,52.25 33.5,52.25 33.02,52.72 GPIO3.8
IO8_SDA  (via drill 0.3)
  Top 0.254: U1.11 38.21,48.04 v38.23,47.99 | R22.1 28.57,20.69 30.42,20.69 v32.99,23.26 | v32.96,34.02 v32.96,38.09
  Bottom 0.254: v38.23,47.99 38.21,48.01 | 38.21,48.01 34.54,51.74 30.67,51.74 30.48,51.93 GPIO3.9 | v32.96,38.09 38.21,43.34 38.21,48.01 | v32.99,23.26 32.99,33.99 v32.96,34.02
IO9_SCL  (via drill 0.3)
  Top 0.254: U1.12 36.71,48.08 v36.7,47.99 | v31.5,38.09 v31.5,34.02 | R23.1 v29.75,22.75
  Bottom 0.254: GPIO3.10 27.94,51.55 28.45,51.04 33.75,51.04 v36.7,47.99 36.7,43.29 v31.5,38.09 | v29.75,22.75 31.5,24.5 v31.5,34.02
IO10  (via drill 0.3)
  Top 0.254: U1.13 35.18,46.77 v35.18,47.99
  Bottom 0.254: v35.18,47.99 32.96,50.28 26.15,50.28 25.4,51.03 GPIO3.11
IO11  (via drill 0.3)
  Top 0.254: U1.14 v33.71,47.99 v33.72,47.99
  Bottom 0.254: v33.72,47.99 32.29,49.42 23.61,49.42 22.86,50.17 GPIO3.12
IO12  (via drill 0.3)
  Top 0.254: U1.15 32.23,46.75 v32.23,47.99
  Bottom 0.254: v32.23,47.99 31.5,48.72 21.87,48.72 20.32,50.27 GPIO3.13
IO13  (via drill 0.3)
  Top 0.254: U1.16 30.71,47.97 v30.73,47.99
  Bottom 0.254: GPIO3.14 17.78,51.48 21.27,47.99 v30.73,47.99
IO14  (via drill 0.3)
  Top 0.254: U1.17 28.68,44.74 v28.7,44.75
  Bottom 0.254: v28.7,44.75 23.43,44.75 15.24,52.94 GPIO3.15
IO15  (via drill 0.3)
  Top 0.254: U1.18 28.71,43.24 v28.7,43.23
  Bottom 0.254: v28.7,43.23 23.97,43.23 12.7,54.5 GPIO3.16
IO16  (via drill 0.3)
  Top 0.254: U1.19 28.74,41.74 v28.7,41.74
  Bottom 0.254: v28.7,41.74 24.93,41.74 14.16,52.5 10.79,52.5 10.16,53.14 GPIO3.17
IO17  (via drill 0.3)
  Top 0.254: U1.20 29.93,40.21 v28.7,40.21
  Bottom 0.254: v28.7,40.21 25.91,40.21 14.04,52.09 8.22,52.09 7.62,52.69 GPIO3.18
IO18  (via drill 0.3)
  Top 0.254: v28.7,38.72 29.94,38.72 U1.21 37.79,38.74 43.43,33.1 v43.43,31.61 | v43.5,24.27 LED2.4-DIN
  Bottom 0.254: GPIO1.1 7.62,14.15 8.18,14.7 8.76,15.29 10.26,16.78 15.43,16.78 25.24,26.59 25.24,37.67 26.29,38.72 v28.7,38.72 | v43.43,31.61 43.43,24.34 v43.5,24.27
IO19  (via drill 0.3)
  Top 0.254: v28.7,37.23 28.62,37.24 U1.22 | R17.1 v46.45,20.08
  Bottom 0.254: GPIO1.2 10.16,14.62 11.81,16.27 17.18,16.27 26.45,25.54 26.45,36.15 27.53,37.23 v28.7,37.23 42.1,37.23 46.2,33.13 46.26,33.07 46.26,26.69 46.26,20.27 v46.45,20.08
IO20  (via drill 0.3)
  Top 0.254: U1.23 29.93,35.7 v28.7,35.7 | R18.1 v44.9,22.12
  Bottom 0.254: v44.9,22.12 44.9,33.01 42.2,35.7 v28.7,35.7 28.13,35.7 27.15,34.72 27.15,25.61 17.43,15.89 13.88,15.89 12.7,14.72 GPIO1.3
IO21  (via drill 0.3)
  Top 0.254: U1.24 v28.71,34.24 v28.7,34.24 28.29,34.24 27.97,33.93 27.97,33.2 27.34,32.56 24.92,32.56 | R13.1 24.92,32.56 | Q3.1 25.18,32.3 24.92,32.56
  Bottom 0.254: v28.7,34.24 28.23,34.24 27.97,33.99 27.97,25.89 17.59,15.51 15.75,15.51 15.24,15 GPIO1.4
IO26  (via drill 0.3)
  Top 0.254: U1.25 28.71,32.74 v28.7,32.75
  Bottom 0.254: GPIO1.5 17.78,15.16 28.7,26.09 v28.7,32.75
IO33  (via drill 0.3)
  Top 0.254: U1.27 30.71,28.01 v30.73,27.99
  Bottom 0.254: v30.73,27.99 30.73,25.86 20.32,15.45 GPIO1.6
IO34  (via drill 0.3)
  Top 0.254: U1.28 32.21,28 v32.23,27.99
  Bottom 0.254: v32.23,27.99 32.23,23.99 22.86,14.62 GPIO1.7
IO35_MOSI  (via drill 0.3)
  Top 0.254: U1.29 33.71,27.96 v33.72,27.99 33.72,27.54 33.47,27.29 24.45,27.29 v24.32,27.42
  Bottom 0.254: v24.32,27.42 24.32,41.26 13.88,51.71 7.92,51.71 6.25,53.38 6.25,73.04 7.67,74.46 U$1.14 | GPIO1.8 25.4,14.46 33.72,22.78 v33.72,27.99
IO36_SCK  (via drill 0.3)
  Top 0.254: U1.30 v35.21,27.99 | v35.21,27.99 | v23.69,27.42 23.69,27.29 24.07,26.91 33.62,26.91 34.7,27.99 v35.21,27.99
  Bottom 0.254: v35.21,27.99 35.21,22.78 35.21,22.37 27.94,15.1 GPIO1.9 | v23.69,27.42 23.69,41.36 13.72,51.33 7.77,51.33 5.87,53.22 5.87,73.2 7.64,74.96 U$1.13
IO37  (via drill 0.3)
  Top 0.254: U1.31 36.71,28 v36.7,27.99
  Bottom 0.254: v36.7,27.99 36.7,20.62 36.7,19.83 30.48,13.61 GPIO1.10
IO38  (via drill 0.3)
  Top 0.254: U1.32 38.23,29.23 v38.23,27.99 38.23,27.04 R14.2 C21.1
  Bottom 0.254: GPIO1.11 33.02,14.3 38.23,19.51 v38.23,27.99
IO39_RST  (via drill 0.3)
  Top 0.254: U1.33 39.71,28.01 v39.69,27.99 39.59,27.99 39.18,27.58 39.18,26.4 39.12,26.34 38.93,26.15 23.53,26.15 22.51,27.16 22.51,27.83 22.7,28.02 v23.06,28.02
  Bottom 0.254: v39.69,27.99 39.69,18.65 35.56,14.53 GPIO1.12 | v23.06,28.02 22.57,28.02 22.1,28.5 22.1,41.33 13.25,50.18 7.29,50.18 4.73,52.74 4.73,73.67 7.52,76.46 U$1.10
IO40_DC  (via drill 0.3)
  Top 0.254: U1.34 v41.21,27.99 | v41.21,27.99 | v23.06,28.66 22.32,28.66 22.13,28.47 22.13,27.01 23.37,25.77 40.83,25.77 41.21,26.15 v41.21,27.99
  Bottom 0.254: v23.06,28.66 22.61,28.66 22.48,28.78 22.48,41.49 13.4,50.56 7.45,50.56 5.11,52.9 5.11,73.52 7.56,75.96 U$1.11 | GPIO1.13 38.1,12.91 41.21,16.02 v41.21,27.99
IO41_CS  (via drill 0.3)
  Top 0.254: U1.35 42.71,27.98 | 42.71,27.98 v42.74,27.99 | v23.06,29.29 22.23,29.29 21.75,28.81 21.75,26.8 23.17,25.39 41.94,25.39 42.74,26.18 42.74,27.96 42.71,27.98
  Bottom 0.254: v23.06,29.29 23.06,41.45 13.56,50.94 7.61,50.94 5.49,53.06 5.49,73.36 7.6,75.46 U$1.12 | GPIO1.14 40.64,13.67 42.74,15.77 v42.74,27.99
IO42_BUSY  (via drill 0.3, 0.35)
  Top 0.254: U1.36 44.21,28.04 v44.23,27.99 44.23,27.13 42.1,25 34.58,25 v34.48,24.91 | v23.06,27.42 23.2,27.27 23.2,27.22 23.89,26.53 33.96,26.53 v34.4,26.97
  Bottom 0.254: v23.06,27.42 v23.05,27.41 22.64,27.41 21.72,28.34 21.72,41.17 13.09,49.8 7.13,49.8 4.35,52.59 4.35,73.83 7.48,76.96 U$1.9 | v34.4,26.97 34.4,24.99 v34.48,24.91 | GPIO1.15 43.18,13.35 44.23,14.4 v44.23,27.99
IO43  (via drill 0.3)
  Top 0.254: U1.37 45.71,28.01 v45.69,27.99
  Bottom 0.254: v45.69,27.99 45.69,11.48 GPIO1.16
IO44  (via drill 0.3)
  Top 0.254: U1.38 v47.21,28.02
  Bottom 0.254: v47.21,28.02 47.62,27.61 47.62,12.08 GPIO1.17
IO45  (via drill 0.3)
  Top 0.254: U1.39 48.71,28.01 v48.74,27.99
  Bottom 0.254: v48.74,27.99 48.74,14.78 50.8,12.72 GPIO1.18
IO46  (via drill 0.3)
  Top 0.254: U1.40 50.21,28.13 v50.2,27.99
  Bottom 0.254: GPIO1.19 51.97,12.82 51.97,12.85 50.2,14.62 v50.2,27.99
N$1  (via drill 0.3)
  Top 0.254: C1.1 13.94,60.95 v13.97,60.98
  Bottom 0.254: v13.97,60.98 13.97,68.22 12.72,69.46 U$1.24
N$2  (via drill 0.3)
  Top 0.254: v16.51,60.98 C2.1 17.78,50.42 17.78,48.91 D2.A
  Bottom 0.254: v16.51,60.98 16.51,67.01 13.56,69.96 U$1.23
N$3  (via drill 0.3)
  Top 0.254: C3.1 v19.05,60.98
  Bottom 0.254: v19.05,60.98 19.05,66.06 14.64,70.46 U$1.22
N$4  (via drill 0.3)
  Top 0.254: v21.59,60.98 C4.1 20.35,50.45 20.35,48.88 D1.C
  Bottom 0.254: v21.59,60.98 21.59,66.06 16.68,70.96 U$1.21
N$5  (via drill 0.3)
  Top 0.254: C5.1 v24.13,60.98
  Bottom 0.254: v24.13,60.98 24.13,67.33 20,71.46 U$1.20
N$6  (via drill 0.3)
  Top 0.254: C6.1 v26.67,60.98
  Bottom 0.254: v26.67,60.98 26.67,68.6 23.3,71.96 U$1.19
N$7  (via drill 0.3)
  Top 0.254: C11.1 v29.21,60.98
  Bottom 0.254: v29.21,60.98 29.21,68.6 25.34,72.46 U$1.18
N$8
  Top 0.254: IC1.1 13.12,16.79 R5.2 R6.2
N$9
  Top 0.254: C14.1 19.3,22.88 19.4,22.78 Q2.2 21.36,18.7 U2.1 | U2.1 21.66,17.51 22.48,16.69 D6.C | U2.1 21.66,19.26 21.91,19.51 23.46,19.51 23.59,19.38 23.59,18.44 U2.3
N$10  (via drill 0.3)
  Top 0.254: R2.1 v44.45,60.98 | Q1.2 27.6,40.04 28.57,41.01 38.89,41.01 41.21,43.32 v52.7,43.32
  Bottom 0.254: v52.7,43.32 52.74,43.36 52.74,55.99 51.69,57.04 45.81,57.04 44.45,58.41 v44.45,60.98 44.45,76.22 40.7,79.96 U$1.3
N$11  (via drill 0.3)
  Top 0.254: C9.1 v39.37,60.98
  Bottom 0.254: v39.37,60.98 39.37,72.41 32.81,78.96 U$1.5
N$12  (via drill 0.3)
  Top 0.254: C7.1 v41.91,60.98
  Bottom 0.254: v41.91,60.98 41.91,74.95 37.4,79.46 U$1.4
N$13  (via drill 0.3)
  Top 0.254: R1.1 v46.99,60.98 | Q1.1 27.11,39.51 38.58,39.51 41.62,42.56 v52.7,42.56
  Bottom 0.254: v52.7,42.56 52.96,42.56 53.24,42.85 53.24,56.31 52.13,57.42 48.32,57.42 46.99,58.75 v46.99,60.98 46.99,77.49 44.02,80.46 U$1.2
N$14
  Bottom 0.254: 55.5,3.02 55.5,0.02
N$15
  Top 0.254: D4.C R6.1
N$16
  Top 0.254: D2.C 20.2,42.69 25.02,42.69 C10.1 24.63,44.34 D3.A
N$17
  Top 0.254: LED2.2-DOUT 38.3,22.84 LED3.4-DIN
N$18
  Top 0.254: D5.A R5.1
N$19
  Top 0.254: D1.A 21.59,45.23 22.13,45.77 25.3,45.77 C10.2 28.06,47.14 28.19,47.01 28.19,43.07 26.48,41.36 25.15,41.36 24.47,40.68 Q1.3 22.38,39.39 21.59,40.18 L1.2
N$20
  Top 0.254: RATE1.1 11.31,24.91 R11.1
N$21
  Top 0.254: RATE2.1 2.1,24.91 2.74,24.27 12.71,24.27 R12.1
N$22
  Top 0.254: LED4.2-DOUT 35.01,16.65 42.61,16.65 44.26,18.3 LED5.4-DIN
N$23
  Top 0.254: J1.B5 50.79,22.85 R15.2
N$24
  Top 0.254: J1.A5 51.32,19.85 R16.2
N$25
  Top 0.254: LED4.4-DIN 35.59,20.97 LED3.2-DOUT
N$26  (via drill 0.35)
  Top 0.508: LSP1.MP CR2032.+$1 v8.89,49.26
  Bottom 0.508: v8.89,49.26 CR2032.+$2
  other vias: 8.89,27.32
N$28
  Bottom 0.254: 54.5,2.02 54.5,0.02
N$29
  Bottom 0.254: 53.5,2.02 53.5,0.02
N$30
  Bottom 0.254: 52.5,2.02 52.5,0.02
N$31
  Bottom 0.254: 51.5,2.02 51.5,0.02
N$32
  Bottom 0.254: 50.5,2.02 50.5,0.02
N$33
  Bottom 0.254: 49.5,2.02 49.5,0.02
N$34
  Bottom 0.254: 48.5,2.02 48.5,0.02
N$35
  Bottom 0.254: 47.5,2.02 47.5,0.02
N$36
  Bottom 0.254: 46.5,2.02 46.5,0.02
N$37
  Bottom 0.254: 45.5,3.02 45.5,0.02
N$38
  Bottom 0.254: 44.5,2.02 44.5,0.02
N$39
  Bottom 0.254: 43.5,2.02 43.5,0.02
N$40
  Bottom 0.254: 42.5,2.02 42.5,0.02
N$41
  Bottom 0.254: 41.5,2.02 41.5,0.02
N$42
  Bottom 0.254: 40.5,2.02 40.5,0.02
N$43
  Bottom 0.254: 39.5,2.02 39.5,0.02
N$44
  Bottom 0.254: 38.5,2.02 38.5,0.02
N$45
  Bottom 0.254: 37.5,2.02 37.5,0.02
N$46
  Bottom 0.254: 36.5,2.02 36.5,0.02
N$47
  Bottom 0.254: 35.5,3.02 35.5,0.02
N$48
  Bottom 0.254: 34.5,2.02 34.5,0.02
N$49
  Bottom 0.254: 33.5,2.02 33.5,0.02
N$50
  Bottom 0.254: 32.5,2.02 32.5,0.02
N$51
  Bottom 0.254: 31.5,2.02 31.5,0.02
N$52
  Bottom 0.254: 30.5,2.02 30.5,0.02
N$53
  Bottom 0.254: 29.5,2.02 29.5,0.02
N$54
  Bottom 0.254: 28.5,2.02 28.5,0.02
N$55
  Bottom 0.254: 27.5,2.02 27.5,0.02
N$56
  Bottom 0.254: 26.5,2.02 26.5,0.02
N$57
  Bottom 0.254: 25.5,3.02 25.5,0.02
N$58
  Bottom 0.254: 24.5,2.02 24.5,0.02
N$59
  Bottom 0.254: 23.5,2.02 23.5,0.02
N$60
  Bottom 0.254: 22.5,2.02 22.5,0.02
N$61
  Bottom 0.254: 21.5,2.02 21.5,0.02
N$62
  Bottom 0.254: 20.5,2.02 20.5,0.02
N$63
  Bottom 0.254: 19.5,2.02 19.5,0.02
N$64
  Bottom 0.254: 18.5,2.02 18.5,0.02
N$65
  Bottom 0.254: 17.5,2.02 17.5,0.02
N$66
  Bottom 0.254: 16.5,2.02 16.5,0.02
N$67
  Bottom 0.254: 15.5,3.02 15.5,0.02
N$68
  Bottom 0.254: 14.5,2.02 14.5,0.02
N$69
  Bottom 0.254: 13.5,2.02 13.5,0.02
N$70
  Bottom 0.254: 12.5,2.02 12.5,0.02
N$71
  Bottom 0.254: 11.5,2.02 11.5,0.02
N$72
  Bottom 0.254: 10.5,2.02 10.5,0.02
N$73
  Bottom 0.254: 9.5,2.02 9.5,0.02
N$74
  Bottom 0.254: 8.5,2.02 8.5,0.02
N$75
  Bottom 0.254: 7.5,2.02 7.5,0.02
N$76
  Bottom 0.254: 6.5,2.02 6.5,0.02
N$77
  Bottom 0.254: 5.5,3.02 5.5,0.02
OUT  (via drill 0.35)  (1 unrouted)
  Top 0.508: LSP3.MP 3.84,55.26 6.92,52.18 12.06,52.18 12.64,51.61 v12.64,49.3 | U2.5 20.7,21.96 v20.7,22.97
  Bottom 0.508: v20.7,22.97 21.21,23.48 21.21,40.96 12.88,49.29 v12.64,49.29
P8  (via drill 0.3)
  Top 0.254: R3.2 34.29,52.09 | 34.29,52.09 v34.29,60.98 | R4.2 34.71,51.67 34.29,52.09
  Bottom 0.254: v34.29,60.98 34.29,69.87 26.7,77.46 U$1.8
PROG  (via drill 0.3)
  Top 0.254: RATE2.2 RATE1.2 v5.02,26.94 | IC1.5 13.12,22.65 R7.1 6.48,22.75 v6.35,22.88
  Bottom 0.254: v5.02,26.94 5.02,23.77 5.91,22.88 v6.35,22.88
V+  (via drill 0.35)
  Top 0.508: v24.61,24.69 24.73,24.56 26.55,24.56 26.84,24.27 LED3.1-VDD 33.4,23.71 33.59,23.51 33.59,22.75 33.05,22.21 32.73,22.21 31.94,21.42 31.94,18.59 32.23,18.3 LED4.1-VDD 33.36,17.49 33.59,17.26 39.97,17.26 40.16,17.44 LED5.1-VDD 41.15,18.3 41.53,18.69 41.53,20.12 | C16.1 25.91,36.35 v25.91,34.97 26.13,34.75 Q3.3 | LED2.1-VDD 41.24,24.27 41.53,23.99 41.53,20.12 | C15.1 46.64,16.24 46.32,16.56 46.32,19 45.66,19.67 41.97,19.67 41.53,20.12
  Bottom 0.508: v25.91,34.97 25.85,34.91 25.85,25.93 v24.61,24.69

### Text on the board
Bottom: 50 | 40 | 30 | 20 | 10 | 0 | mm
tPlace: Maker (Faire) Badge | If you can read this, it means / that you are very curious maker and / that you removed e-paper / from your badge. / / Keep tinkering!
bPlace: This is unofficial Maker Faire badge. / / This badge works as full development / board based on ESP32-S2 module. | Designed by | Based on Bastlíř´s idea to make one. / twitch.tv/bastlir
bStop: 50 | 40 | 30 | 20 | 10 | 0 | mm